# EAGLE design G35InjectorV1 (EAGLE 6.3)
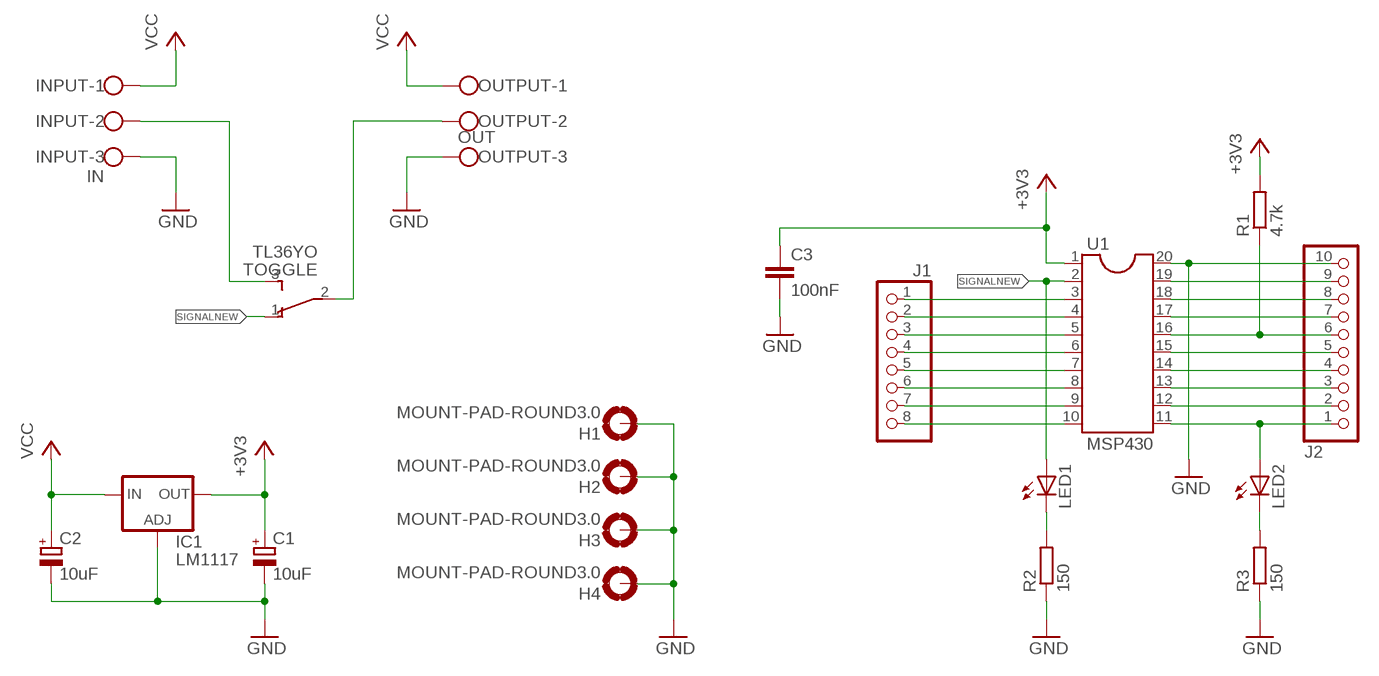
[diagram p0: schematic, sheet 1]

## Parts
C1  10uF  CPOL-EUE5-10.5  [E5-10,5]
C2  10uF  CPOL-EUE5-10.5  [E5-10,5]
C3  100nF  C-EUC0805  [C0805]
H1  MOUNT-PAD-ROUND3.0  [3,0-PAD]
H2  MOUNT-PAD-ROUND3.0  [3,0-PAD]
H3  MOUNT-PAD-ROUND3.0  [3,0-PAD]
H4  MOUNT-PAD-ROUND3.0  [3,0-PAD]
IC1  LM1117  LM317TS  [317TS]
INPUT  IN  W237-103  [W237-103]
J1  PINHD-1X8  [1X08]
J2  PINHD-1X10  [1X10]
LED1  LED5MM  [LED5MM]
LED2  LED5MM  [LED5MM]
OUTPUT  OUT  W237-103  [W237-103]
R1  4.7k  R-EU_R0805  [R0805]
R2  150  R-EU_R0805  [R0805]
R3  150  R-EU_R0805  [R0805]
TOGGLE  TL36YO  [TL3XYO]
U1  MSP430  DIL20S  [SOCKET-20]

## Nets
+3V3: C1.+ C3.1 IC1.2(OUT) R1.2 U1.1
GND: C1.- C2.- C3.2 H1.B3,0(MOUNT) H2.B3,0(MOUNT) H3.B3,0(MOUNT) H4.B3,0(MOUNT) IC1.1(ADJ) INPUT.3 J2.10 OUTPUT.3 R2.1 R3.1 U1.20
N$1: J1.1 U1.3
N$2: J1.2 U1.4
N$3: J1.3 U1.5
N$4: J1.4 U1.6
N$5: J1.5 U1.7
N$6: J1.6 U1.8
N$7: J1.7 U1.9
N$8: J1.8 U1.10
N$9: J2.9 U1.19
N$10: J2.8 U1.18
N$11: J2.7 U1.17
N$12: J2.6 R1.1 U1.16
N$13: J2.5 U1.15
N$14: J2.4 U1.14
N$15: J2.3 U1.13
N$16: J2.2 U1.12
N$17: J2.1 LED2.A U1.11
N$18: INPUT.2 TOGGLE.3(S)
N$19: OUTPUT.2 TOGGLE.2(P)
N$20: LED1.K(C) R2.2
N$21: LED2.K(C) R3.2
SIGNALNEW: LED1.A TOGGLE.1(O) U1.2
VCC: C2.+ IC1.3(IN) INPUT.1 OUTPUT.1

## Library data of the parts
C1 C2 = rcl:CPOL-EU: POLARIZED CAPACITOR, European symbol
C3 = rcl:C-EU: CAPACITOR, European symbol
H1-H4 = holes:MOUNT-PAD-ROUND: MOUNTING PAD, round
IC1 = v-reg:LM317TS: VOLTAGE REGULATOR
INPUT OUTPUT = con-wago-500:W237-103: WAGO SCREW CLAMP; MPN: 237-103; OC_FARNELL: unknown; OC_NEWARK: 18M7116
J1 = pinhead:PINHD-1X8: PIN HEADER
J2 = pinhead:PINHD-1X10: PIN HEADER
LED1 LED2 = led:LED: LED OSRAM: - CHIPLED LG R971, LG N971, LY N971, LG Q971, LY Q971, LO R971, LY R971 LH N974, LH R974 LS Q976, LO Q976, LY Q976 LO Q996 - Hyper CHIPLED LW Q18S LB Q993, LB Q99A, LB R99A - SideLED LS A670, LO A670, LY A670, LG A670, LP A670 LB A673, LV A673, LT A673, LW A673 LH A674 LY A675 LS A676, LA A676, LO A676, LY A676, LW A676 LS A679, LY A679, LG A679 - Hyper Micro SIDELED® LS Y876, LA Y876, LO Y876, LY Y876 LT Y87S - SmartLED LW L88C, LW L88S LB L89C, LB L89S, LG L890 LS L89K, LO L89K, LY L89K LS L896, LA L896, LO L896, LY L896 - TOPLED LS T670, LO T670, LY T670, LG T670, LP T670 LSG T670, LSP T670, LSY T670, LOP T670, LYG T670 LG T671, LOG T671, LSG T671 LB T673, LV T673, LT T673, LW T673 LH T674 LS T676, LA T676, LO T676, LY T676, LB T676, LH T676, LSB T676, LW T676 LB T67C, LV T67C, LT T67C, LS T67K, LO T67K, LY T67K, LW E67C LS E67B, LA E67B, LO E67B, LY E67B, LB E67C, LV E67C, LT E67C LW T67C LS T679, LY T679, LG T679 LS T770, LO T770, LY T770, LG T770, LP T770 LB T773, LV T773, LT T773, LW T773 LH T774 LS E675, LA E675, LY E675, LS T675 LS T776, LA T776, LO T776, LY T776, LB T776 LHGB T686 LT T68C, LB T68C - Hyper Mini TOPLED® LB M676 - Mini TOPLED Santana® LG M470 LS M47K, LO M47K, LY M47K Source: http://www.osram.convergy.de LUXEON: - LUMILED® LXK2-PW12-R00, LXK2-PW12-S00, LXK2-PW14-U00, LXK2-PW14-V00 LXK2-PM12-R00, LXK2-PM12-S00, LXK2-PM14-U00 LXK2-PE12-Q00, LXK2-PE12-R00, LXK2-PE12-S00, LXK2-PE14-T00, LXK2-PE14-U00 LXK2-PB12-K00, LXK2-PB12-L00, LXK2-PB12-M00, LXK2-PB14-N00, LXK2-PB14-P00, LXK2-PB14-Q00 LXK2-PR12-L00, LXK2-PR12-M00, LXK2-PR14-Q00, LXK2-PR14-R00 LXK2-PD12-Q00, LXK2-PD12-R00, LXK2-PD12-S00 LXK2-PH12-R00, LXK2-PH12-S00 LXK2-PL12-P00, LXK2-PL12-Q00, LXK2-PL12-R00 Source: www.luxeon.com KINGBRIGHT: KA-3528ASYC Source: www.kingbright.com
R1-R3 = rcl:R-EU_: RESISTOR, European symbol
TOGGLE = switch:TL36YO: TINY SWITCH ON - ON Source: http://www2.produktinfo.conrad.com/datenblaetter/700000-724999/705152-da-01-de-Subminiaturschalter_TL_36YO.pdf
U1 = ic-package:DIL20: Dual In Line / Socket

## Net classes
0 default: clearance 0.205 mm
1 HighCurrent: width 1.27 mm, drill 1.27 mm, clearance 6.35 mm to class 0, clearance 6.35 mm

## Board
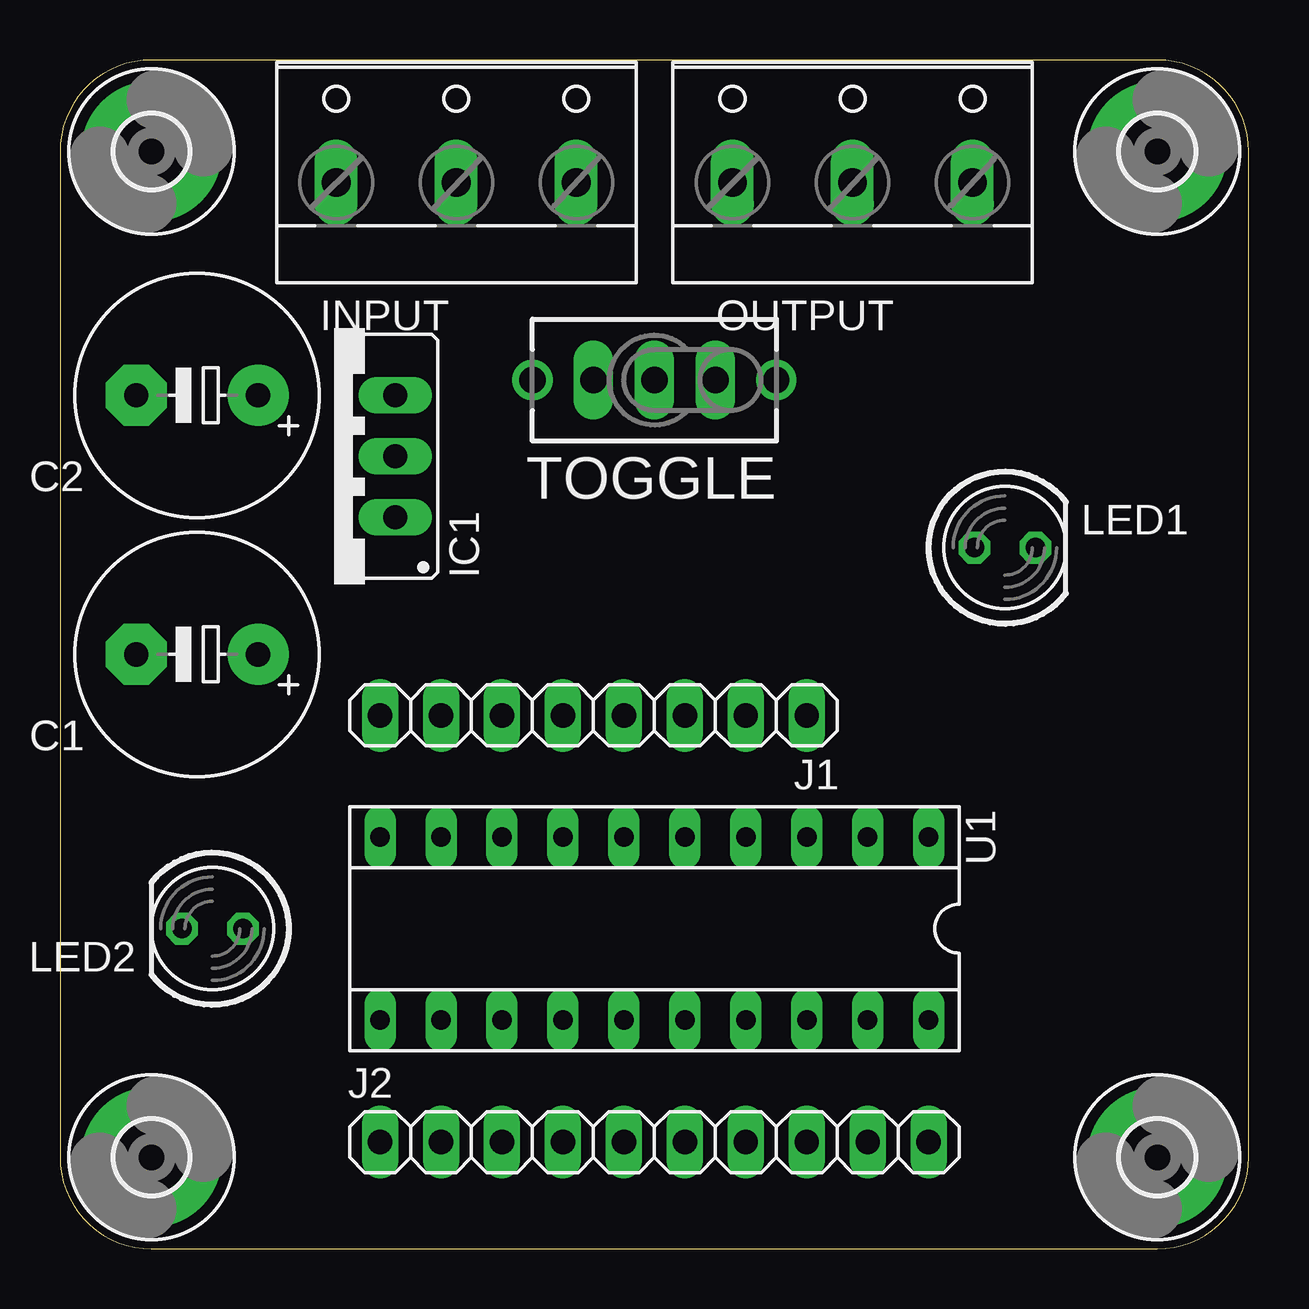
[diagram p1: board, top side]
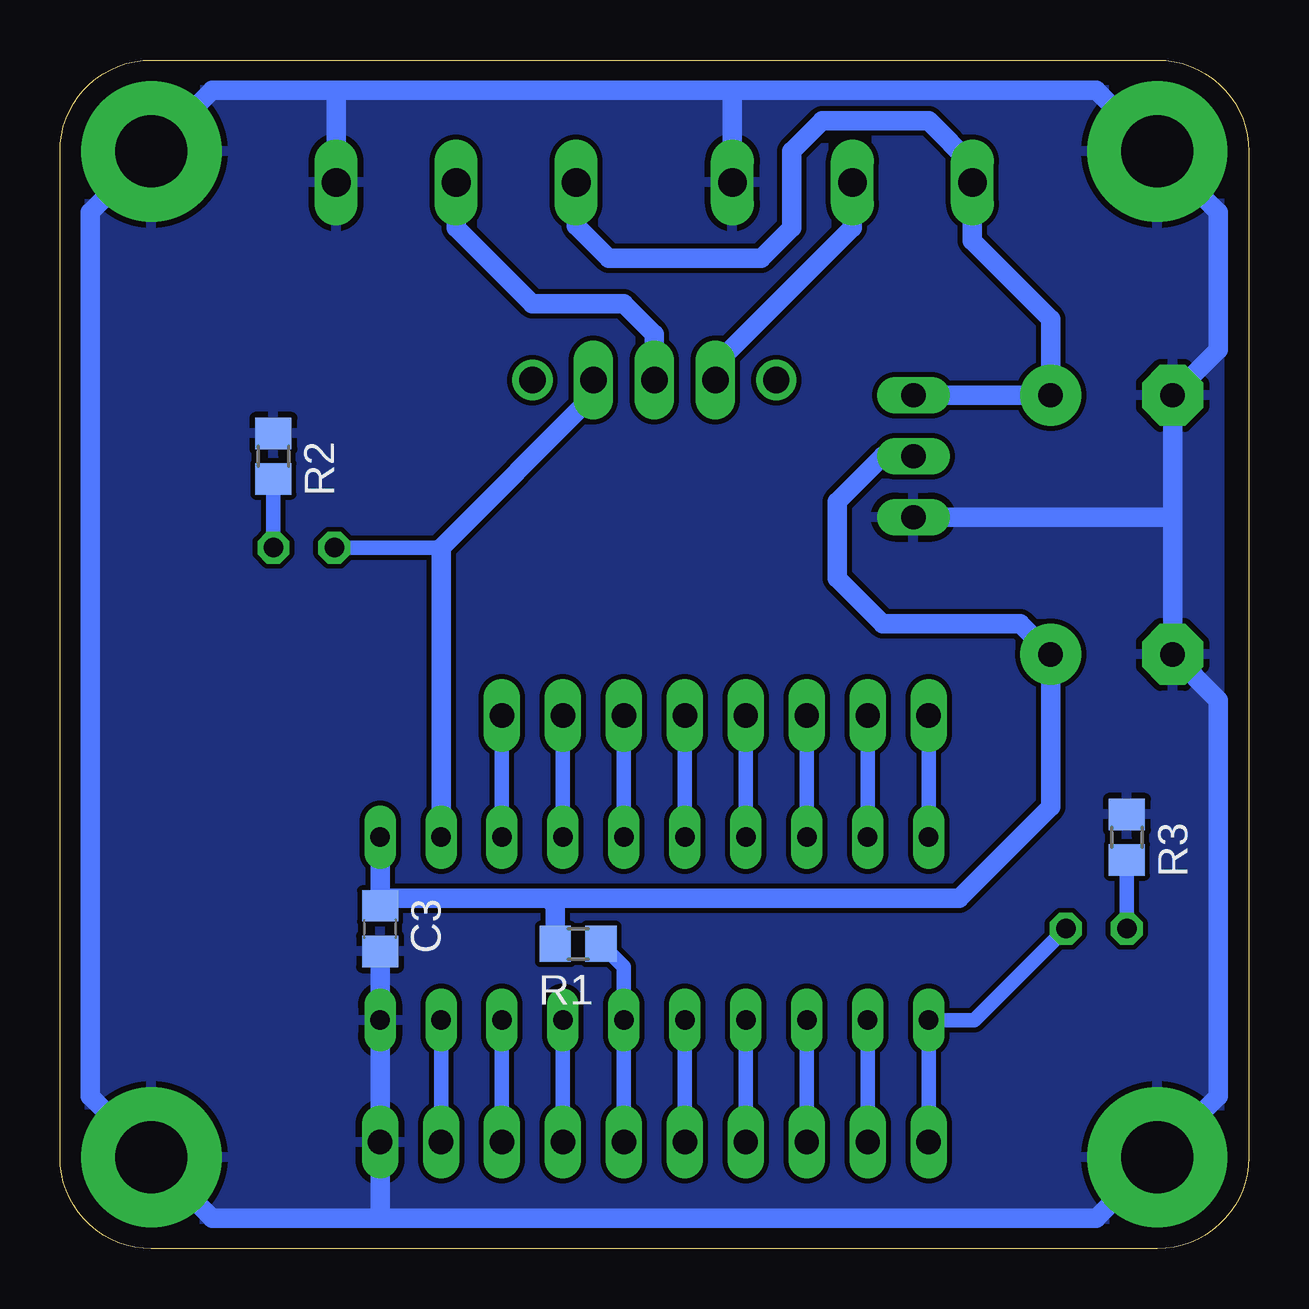
[diagram p2: board, bottom side, seen from below]

Size 49.53 x 49.53 mm. Coordinates in mm from the lower left corner, seen from the top.
Outline: 0,45.72 0,3.81 arc90 3.81,0 45.72,0 arc90 49.53,3.81 49.53,45.72 arc90 45.72,49.53 3.81,49.53 arc90 0,45.72
Copper layers (1*16): Top 0.035mm / dielectric 1.5mm / Bottom 0.035mm
Design rules "default": minimum track width 10mil, minimum drill 24mil, track to track 8mil, track to pad 8mil, pad to pad 8mil, via to via 8mil, smd to smd 8mil, copper to edge 40mil, drill to drill 8mil, minimum pad ring 10mil, minimum via ring 8mil, stop-mask expansion 4mil, vias tented up to drill 0mil, thermal gap 10mil

### Footprints (pad centres in the part's own frame; a part is rotated, then mirrored left to right if it is on the bottom)
E5-10,5 = drill 1.016 pad 2.54: + -2.54,0 | drill 1.016 pad 2.54 octagon: - 2.54,0
C0805 = smd 1.3 x 1.5: 1 -0.95,0; 2 0.95,0
3,0-PAD = drill 3 pad 5.842: B3,0 0,0
317TS = drill 1.016 long: 1 -2.54,-2.54; 2 0,-2.54; 3 2.54,-2.54
W237-103 = drill 1.194 long: 1 -5,-1.29; 2 0,-1.29; 3 5,-1.29
1X08 = drill 1.016 long: 1 -8.89,0; 2 -6.35,0; 3 -3.81,0; 4 -1.27,0; 5 1.27,0; 6 3.81,0; 7 6.35,0; 8 8.89,0
1X10 = drill 1.016 long: 1 -11.43,0; 2 -8.89,0; 3 -6.35,0; 4 -3.81,0; 5 -1.27,0; 6 1.27,0; 7 3.81,0; 8 6.35,0; 9 8.89,0; 10 11.43,0
LED5MM = drill 0.813 octagon: A -1.27,0; K 1.27,0
R0805 = smd 1.3 x 1.5: 1 -0.95,0; 2 0.95,0
TL3XYO = drill 1.1 pad 1.422 long: 1 -2.54,0; 2 0,0; 3 2.54,0 | drill 1.1 pad 1.676: M1 -5.08,0; M2 5.08,0
SOCKET-20 = drill 0.813 long: 1 -11.43,-3.81; 2 -8.89,-3.81; 3 -6.35,-3.81; 4 -3.81,-3.81; 5 -1.27,-3.81; 6 1.27,-3.81; 7 3.81,-3.81; 8 6.35,-3.81; 9 8.89,-3.81; 10 11.43,-3.81; 11 11.43,3.81; 12 8.89,3.81; 13 6.35,3.81; 14 3.81,3.81; 15 1.27,3.81; 16 -1.27,3.81; 17 -3.81,3.81; 18 -6.35,3.81; 19 -8.89,3.81; 20 -11.43,3.81

### Placement (x,y rotation side)
C1  5.71,24.77 180 top
C2  5.71,35.56 180 top
C3  36.2,13.34 270 bottom
H1  3.81,3.81 0 top
H2  45.72,45.72 0 top
H3  45.72,3.81 0 top
H4  3.81,45.72 0 top
IC1  11.43,33.02 90 top
INPUT  16.51,45.72 0 top
J1  22.23,22.23 180 top
J2  24.77,4.45 0 top
LED1  39.37,29.21 0 top
LED2  6.35,13.34 180 top
OUTPUT  33.02,45.72 0 top
R1  27.94,12.7 180 bottom
R2  40.64,33.02 270 bottom
R3  5.08,17.14 270 bottom
TOGGLE  24.77,36.2 180 top
U1  24.77,13.34 180 top

### Tracks (layer width: path | path; a pad name or v marks a point on that pad's centre or on a via)
+3V3
  Bottom 0.813: IC1.2 15.24,33.02 17.14,31.11 17.14,27.94 15.24,26.04 9.53,26.04 C1.+ 8.26,18.41 12.06,14.61 29.21,14.61 | 29.21,14.61 35.88,14.61 C3.1 U1.1 | R1.2 28.89,14.29 29.21,14.61
GND
  Bottom 0.813: 21.59,48.26 6.35,48.26 H4.B3,0 1.27,43.18 1.27,37.47 C2.- 3.17,30.48 | 21.59,48.26 38.1,48.26 | 38.1,48.26 43.18,48.26 H2.B3,0 48.26,43.18 48.26,6.35 H3.B3,0 43.18,1.27 36.2,1.27 | INPUT.3 21.51,48.18 21.59,48.26 | OUTPUT.3 38.02,48.18 38.1,48.26 | 3.17,30.48 C1.- 1.27,22.86 1.27,6.35 H1.B3,0 6.35,1.27 36.2,1.27 | 36.2,1.27 J2.10 U1.20 C3.2 | IC1.1 3.17,30.48
  pour Bottom: 0,49.53 49.53,49.53 49.53,0 0,0
N$1
  Bottom 0.61: J1.1 U1.3
N$2
  Bottom 0.61: J1.2 U1.4
N$3
  Bottom 0.61: U1.5 J1.3
N$4
  Bottom 0.61: J1.4 U1.6
N$5
  Bottom 0.61: U1.7 J1.5
N$6
  Bottom 0.61: J1.6 U1.8
N$7
  Bottom 0.61: U1.9 J1.7
N$8
  Bottom 0.61: J1.8 U1.10
N$9
  Bottom 0.61: J2.9 U1.19
N$10
  Bottom 0.61: U1.18 J2.8
N$11
  Bottom 0.61: J2.7 U1.17
N$12
  Bottom 0.61: R1.1 26.04,11.74 U1.16 J2.6
N$13
  Bottom 0.61: U1.15 J2.5
N$14
  Bottom 0.61: U1.14 J2.4
N$15
  Bottom 0.61: U1.13 J2.3
N$16
  Bottom 0.61: U1.12 J2.2
N$17
  Bottom 0.61: J2.1 U1.11 11.43,9.53 LED2.A
N$18
  Bottom 0.813: INPUT.2 16.51,42.55 22.23,36.83 TOGGLE.3
N$19
  Bottom 0.813: OUTPUT.2 33.02,42.55 29.84,39.37 26.04,39.37 24.77,38.1 TOGGLE.2
N$20
  Bottom 0.61: LED1.K R2.2
N$21
  Bottom 0.61: LED2.K R3.2
SIGNALNEW
  Bottom 0.61: LED1.A 33.66,29.21
  Bottom 0.813: TOGGLE.1 27.3,35.56 33.66,29.21 U1.2
VCC
  Bottom 0.813: IC1.3 C2.+ 8.26,38.73 11.51,41.99 INPUT.1 11.51,45.16 13.34,46.99 17.78,46.99 19.05,45.72 19.05,42.55 20.32,41.27 26.67,41.27 28.02,42.62 OUTPUT.1